# Altium schematic sheet Sheet12.SchDoc
size A4; SheetNumber: 2; SheetTotal: 3
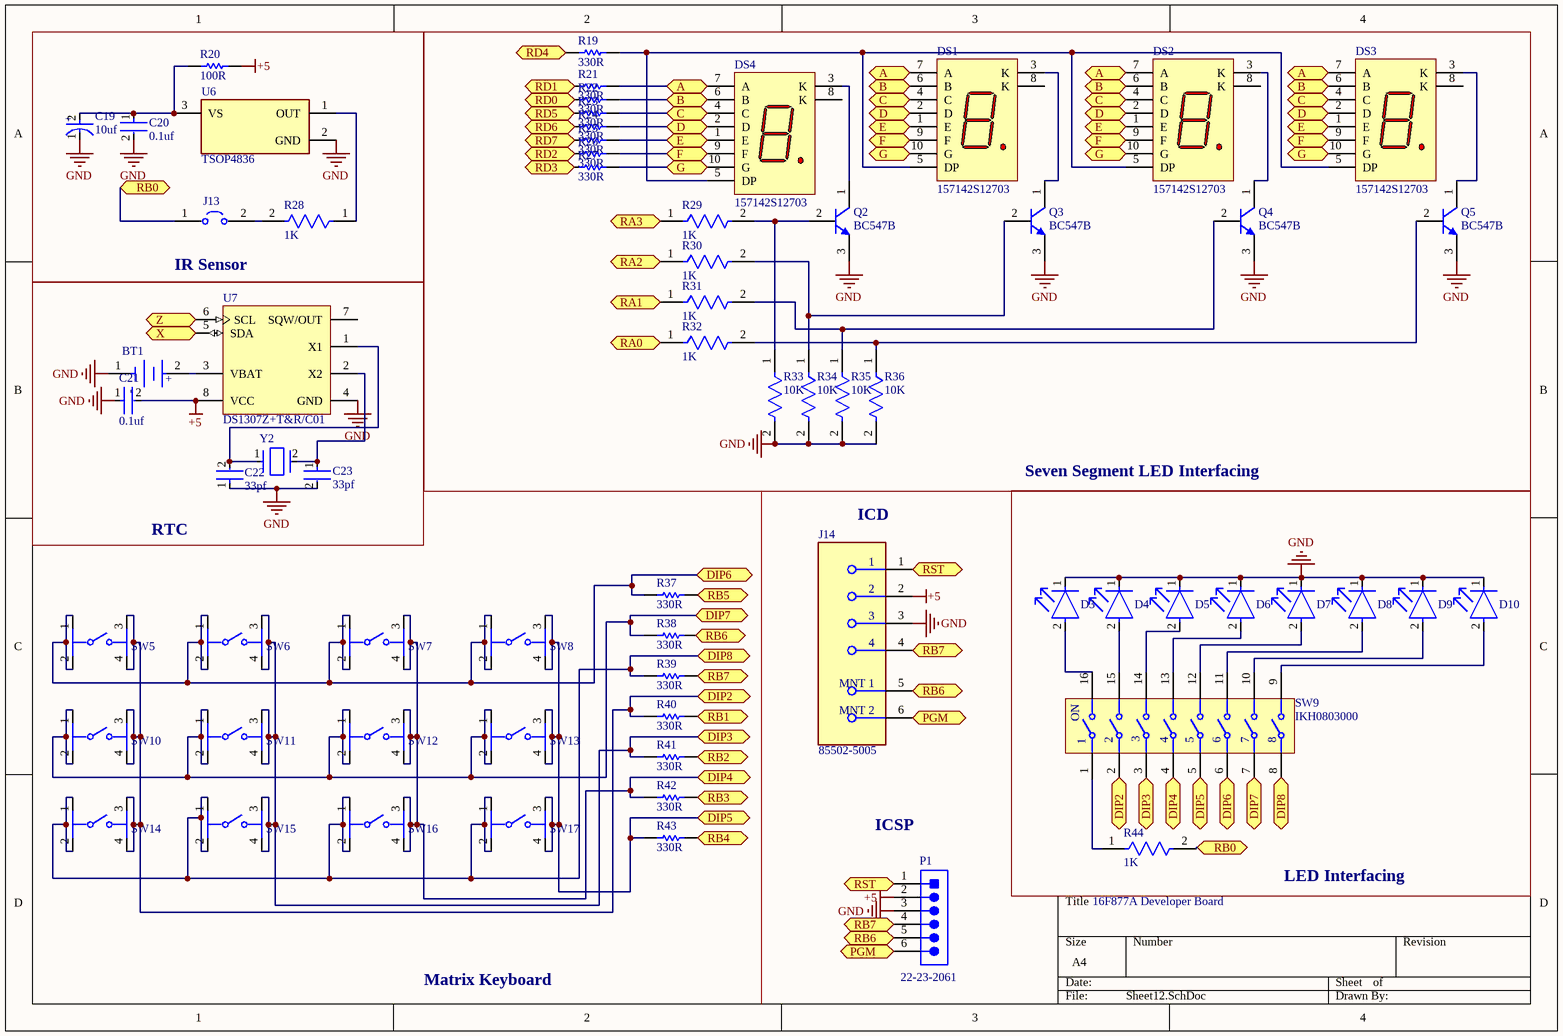
[diagram p0: Sheet12.SchDoc]

## Parts
BT1  3034  [FP-3034-MFG]  (value not drawn)
C19  10uf  [FP-OS-CON-TH-E12-d_0_6-MFG]
C20  0.1uf  [FP-C1206C-EB-MFG]
C21  0.1uf  [FP-C1206C-EB-MFG]
C22  33pf  [FP-RDE1K1-MFG]
C23  33pf  [FP-RDE1K1-MFG]
D3  XLUR12D  [FP-XLUR12D-MFG]  (value not drawn)
D4  XLUR12D  [FP-XLUR12D-MFG]  (value not drawn)
D5  XLUR12D  [FP-XLUR12D-MFG]  (value not drawn)
D6  XLUR12D  [FP-XLUR12D-MFG]  (value not drawn)
D7  XLUR12D  [FP-XLUR12D-MFG]  (value not drawn)
D8  XLUR12D  [FP-XLUR12D-MFG]  (value not drawn)
D9  XLUR12D  [FP-XLUR12D-MFG]  (value not drawn)
D10  XLUR12D  [FP-XLUR12D-MFG]  (value not drawn)
DS1  157142S12703  [WL-T7DS_L19W12.6H7.9]
DS2  157142S12703  [WL-T7DS_L19W12.6H7.9]
DS3  157142S12703  [WL-T7DS_L19W12.6H7.9]
DS4  157142S12703  [WL-T7DS_L19W12.6H7.9]
J13  S1911-46R  [FP-S1911-46R-MFG]  (value not drawn)
J14  85502-5005  [FP-85502-5005-MFG]
P1  22-23-2061  [MOLX-22-23-2061_V]
Q2  BC547B  [ONSC-TO-92-3-29-11]
Q3  BC547B  [ONSC-TO-92-3-29-11]
Q4  BC547B  [ONSC-TO-92-3-29-11]
Q5  BC547B  [ONSC-TO-92-3-29-11]
R19  330R  [RESC3226X70X40ML20T20]
R20  100R  [RESC3116X65X40NL10T20]
R21  330R  [RESC3226X70X40ML20T20]
R22  330R  [RESC3226X70X40ML20T20]
R23  330R  [RESC3226X70X40ML20T20]
R24  330R  [RESC3226X70X40ML20T20]
R25  330R  [RESC3226X70X40ML20T20]
R26  330R  [RESC3226X70X40ML20T20]
R27  330R  [RESC3226X70X40ML20T20]
R28  1K  [FP-RQ732B-IPC_C]
R29  1K  [FP-RQ732B-IPC_C]
R30  1K  [FP-RQ732B-IPC_C]
R31  1K  [FP-RQ732B-IPC_C]
R32  1K  [FP-RQ732B-IPC_C]
R33  10K  [FP-CF18-MFG]
R34  10K  [FP-CF18-MFG]
R35  10K  [FP-CF18-MFG]
R36  10K  [FP-CF18-MFG]
R37  330R  [RESC3226X70X40ML20T20]
R38  330R  [RESC3226X70X40ML20T20]
R39  330R  [RESC3226X70X40ML20T20]
R40  330R  [RESC3226X70X40ML20T20]
R41  330R  [RESC3226X70X40ML20T20]
R42  330R  [RESC3226X70X40ML20T20]
R43  330R  [RESC3226X70X40ML20T20]
R44  1K  [FP-RQ732B-IPC_C]
SW5  TL3305AF260QG  [FP-TL3305AF260QG-MFG]  (value not drawn)
SW6  TL3305AF260QG  [FP-TL3305AF260QG-MFG]  (value not drawn)
SW7  TL3305AF260QG  [FP-TL3305AF260QG-MFG]  (value not drawn)
SW8  TL3305AF260QG  [FP-TL3305AF260QG-MFG]  (value not drawn)
SW9  IKH0803000  [IKH0803000_MFG]
SW10  TL3305AF260QG  [FP-TL3305AF260QG-MFG]  (value not drawn)
SW11  TL3305AF260QG  [FP-TL3305AF260QG-MFG]  (value not drawn)
SW12  TL3305AF260QG  [FP-TL3305AF260QG-MFG]  (value not drawn)
SW13  TL3305AF260QG  [FP-TL3305AF260QG-MFG]  (value not drawn)
SW14  TL3305AF260QG  [FP-TL3305AF260QG-MFG]  (value not drawn)
SW15  TL3305AF260QG  [FP-TL3305AF260QG-MFG]  (value not drawn)
SW16  TL3305AF260QG  [FP-TL3305AF260QG-MFG]  (value not drawn)
SW17  TL3305AF260QG  [FP-TL3305AF260QG-MFG]  (value not drawn)
U6  TSOP4836  [FP-6_550-5169_01-4-MFG]
U7  DS1307Z+T&R/C01  [S8+2_N]
Y2  ECS-80-20-4X  [FP-ECS-80-20-4X-MFG]  (value not drawn)

## Blocks framed on the sheet
IR Sensor: C19 C20 J13 R20 R28 U6
Seven Segment LED Interfacing: DS1-DS4 Q2-Q5 R19 R21-R27 R29-R36
RTC: BT1 C21-C23 U7 Y2

## Ports
A (bidir, see Sheet12[2A], Sheet12[3A]), A (bidir, see Sheet12[2A], Sheet12[3A], Sheet12[4A]), A (bidir, see Sheet12[3A], Sheet12[4A]), B (bidir, see Sheet12[2A], Sheet12[3A]), B (bidir, see Sheet12[2A], Sheet12[3A], Sheet12[4A]), B (bidir, see Sheet12[3A], Sheet12[4A]), C (bidir, see Sheet12[2A], Sheet12[3A]), C (bidir, see Sheet12[2A], Sheet12[3A], Sheet12[4A]), C (bidir, see Sheet12[3A], Sheet12[4A]), D (bidir, see Sheet12[2A], Sheet12[3A]), D (bidir, see Sheet12[2A], Sheet12[3A], Sheet12[4A]), D (bidir, see Sheet12[3A], Sheet12[4A]), DIP2 (bidir, see Sheet12[2C]), DIP2 (bidir, see Sheet12[3D]), DIP3 (bidir, see Sheet12[2C]), DIP3 (bidir, see Sheet12[3D]), DIP4 (bidir, see Sheet12[2D]), DIP4 (bidir, see Sheet12[4D]), DIP5 (bidir, see Sheet12[2D]), DIP5 (bidir, see Sheet12[4D]), DIP6 (bidir, see Sheet12[2C]), DIP6 (bidir, see Sheet12[4D]), DIP7 (bidir, see Sheet12[2C]), DIP7 (bidir, see Sheet12[4D]), DIP8 (bidir, see Sheet12[2C]), DIP8 (bidir, see Sheet12[4D]), E (bidir, see Sheet12[2A], Sheet12[3A]), E (bidir, see Sheet12[2A], Sheet12[3A], Sheet12[4A]), E (bidir, see Sheet12[3A], Sheet12[4A]), F (bidir, see Sheet12[2A], Sheet12[3A]), F (bidir, see Sheet12[2A], Sheet12[3A], Sheet12[4A]), F (bidir, see Sheet12[3A], Sheet12[4A]), G (bidir, see Sheet12[2A], Sheet12[3A]), G (bidir, see Sheet12[2A], Sheet12[3A], Sheet12[4A]), G (bidir, see Sheet12[3A], Sheet12[4A]), PGM (bidir, see Sheet11[4A], Sheet12[3C]), PGM (bidir, see Sheet11[4A], Sheet12[3D]), RA0 (bidir, see Sheet11[3A], Sheet14[2A]), RA1 (bidir, see Sheet11[3A], Sheet14[2A]), RA2 (bidir, see Sheet11[3A], Sheet14[2A]), RA3 (bidir, see Sheet11[3A], Sheet14[2A]), RB0 (bidir, see Sheet11[1D], Sheet11[3A], Sheet12[1A], Sheet14[3A]), RB0 (bidir, see Sheet11[1D], Sheet11[3A], Sheet12[4D], Sheet14[3A]), RB1 (bidir, see Sheet11[3A], Sheet11[4A], Sheet14[3A]), RB2 (bidir, see Sheet11[3A], Sheet14[2C], Sheet14[3A]), RB3 (bidir, see Sheet11[3A], Sheet14[2C], Sheet14[3A]), RB4 (bidir, see Sheet11[3A], Sheet14[3B]), RB5 (bidir, see Sheet11[3B], Sheet14[3B]), RB6 (bidir, see Sheet11[3B], Sheet12[2C], Sheet12[3C], Sheet14[3A]), RB6 (bidir, see Sheet11[3B], Sheet12[2C], Sheet12[3D], Sheet14[3A]), RB6 (bidir, see Sheet11[3B], Sheet12[3C], Sheet12[3D], Sheet14[3A]), RB7 (bidir, see Sheet11[3B], Sheet12[2C], Sheet12[3C], Sheet14[3A]), RB7 (bidir, see Sheet11[3B], Sheet12[2C], Sheet12[3D], Sheet14[3A]), RB7 (bidir, see Sheet11[3B], Sheet12[3C], Sheet12[3D], Sheet14[3A]), RD0 (bidir, see Sheet11[2B], Sheet11[3C], Sheet14[3A]), RD1 (bidir, see Sheet11[2B], Sheet11[3C], Sheet14[3A]), RD2 (bidir, see Sheet11[2B], Sheet11[3D], Sheet14[3A]), RD3 (bidir, see Sheet11[2B], Sheet11[3D], Sheet14[3A]), RD4 (bidir, see Sheet11[2B], Sheet11[3D], Sheet14[3A]), RD5 (bidir, see Sheet11[2B], Sheet11[3D], Sheet14[3A]), RD6 (bidir, see Sheet11[2B], Sheet11[3D], Sheet14[3A]), RD7 (bidir, see Sheet11[2B], Sheet11[3D], Sheet14[3A]), RST (bidir, see Sheet11[2A], Sheet12[3C]), RST (bidir, see Sheet11[2A], Sheet12[3D]), X (bidir, see Sheet11[2D], Sheet11[3A]), Z (bidir, see Sheet11[2D], Sheet11[4A])

## Nets
+5: C21.2 J14.2 P1.2 R20.1 U7.8(VCC)
GND: BT1.1(C) C19.1(C) C20.2 C21.1 C22.1 C23.2 D3.1(C) D4.1(C) D5.1(C) D6.1(C) D7.1(C) D8.1(C) D9.1(C) D10.1(C) J14.3 P1.3 Q2.3(E) Q3.3(E) Q4.3(E) Q5.3(E) R33.2 R34.2 R35.2 R36.2 U6.2(GND) U7.4(GND)
A: DS1.7(A) DS2.7(A) DS3.7(A) DS4.7(A) R21.2 ; port A
B: DS1.6(B) DS2.6(B) DS3.6(B) DS4.6(B) R22.2 ; port B
C: DS1.4(C) DS2.4(C) DS3.4(C) DS4.4(C) R23.2 ; port C
D: DS1.2(D) DS2.2(D) DS3.2(D) DS4.2(D) R24.2 ; port D
DIP2: R40.1 SW5.3 SW5.4 SW10.3 SW10.4 SW14.3 SW14.4 ; port DIP2
DIP3: R41.1 SW6.3 SW6.4 SW11.3 SW11.4 SW15.3 SW15.4 ; port DIP3
DIP4: R42.1 SW7.3 SW7.4 SW12.3 SW12.4 SW16.3 SW16.4 ; port DIP4
DIP5: R43.1 SW8.3 SW8.4 SW13.3 SW13.4 SW17.3 SW17.4 ; port DIP5
DIP6: R37.1 SW5.1 SW5.2 SW6.1 SW6.2 SW7.1 SW7.2 SW8.1 SW8.2 ; port DIP6
DIP7: R38.1 SW10.1 SW10.2 SW11.1 SW11.2 SW12.1 SW12.2 SW13.1 SW13.2 ; port DIP7
DIP8: R39.1 SW14.1 SW14.2 SW15.1 SW15.2 SW16.1 SW16.2 SW17.1 SW17.2 ; port DIP8
E: DS1.1(E) DS2.1(E) DS3.1(E) DS4.1(E) R25.2 ; port E
F: DS1.9(F) DS2.9(F) DS3.9(F) DS4.9(F) R26.2 ; port F
G: DS1.10(G) DS2.10(G) DS3.10(G) DS4.10(G) R27.2 ; port G
PGM: J14.6(MNT_2) P1.6 ; port PGM
RA0: R32.1 ; port RA0
RA1: R31.1 ; port RA1
RA2: R30.1 ; port RA2
RA3: R29.1 ; port RA3
RB0: J13.1 R44.2 ; port RB0
RB1: R40.2 ; port RB1
RB2: R41.2 ; port RB2
RB3: R42.2 ; port RB3
RB4: R43.2 ; port RB4
RB5: R37.2 ; port RB5
RB6: J14.5(MNT_1) P1.5 ; port RB6
RB7: J14.4 P1.4 R39.2 ; port RB7
RD4: R19.1 ; port RD4
RST: J14.1 P1.1 ; port RST
X: U7.5(SDA) ; port X
Z: U7.6(SCL) ; port Z
NetBT1_2: BT1.2(A) U7.3(VBAT)
NetC19_2: C19.2(A) C20.1 R20.2 U6.3(VS)
NetC22_2: C22.2 U7.1(X1) Y2.1
NetC23_1: C23.1 U7.2(X2) Y2.2
NetD3_2: D3.2(A) SW9.16
NetD4_2: D4.2(A) SW9.15
NetD5_2: D5.2(A) SW9.14
NetD6_2: D6.2(A) SW9.13
NetD7_2: D7.2(A) SW9.12
NetD8_2: D8.2(A) SW9.11
NetD9_2: D9.2(A) SW9.10
NetD10_2: D10.2(A) SW9.9
NetDS1_3: DS1.3(K) Q3.1(C)
NetDS1_5: DS1.5(DP) DS2.5(DP) DS3.5(DP) DS4.5(DP) R19.2
NetDS2_3: DS2.3(K) Q4.1(C)
NetDS3_3: DS3.3(K) Q5.1(C)
NetDS4_3: DS4.3(K) Q2.1(C)
NetJ13_2: J13.2 R28.2
NetQ2_2: Q2.2(B) R29.2 R33.1
NetQ3_2: Q3.2(B) R30.2 R34.1
NetQ4_2: Q4.2(B) R31.2 R35.1
NetQ5_2: Q5.2(B) R32.2 R36.1
NetR28_1: R28.1 U6.1(OUT)
NetR44_1: R44.1 SW9.1

Not connected (* = marked no-connect by the designer): DS1 8(K); DS2 8(K); DS3 8(K); DS4 8(K); R21 1; R22 1; R23 1; R24 1; R25 1; R26 1; R27 1; R38 2; SW9 2 3 4 5 6 7 8; U7 7(SQW/OUT)

## Notes on the sheet
- (near J14) ICD
- (near P1) ICSP
- (near R44) 16F877A Developer Board
- LED Interfacing
- Matrix Keyboard
- (in symbol CMP-00638-06323270-1) ON
- (in symbol CMP-05428-000118-1) +
- (in symbol CMP-19636-000006-1) +; -

## Library data of the parts
BT1 = CMP-19636-000006-1: BATTERY RETAINER COIN 20MM SMD; Manufacturer: Keystone Electronics; Number Of Contacts: 2; Height: 4.31mm; Device Class L1: Connectors; Device Class L3: unset; RoHS: TRUE; Automotive: No; Mouser Description: Coin Cell Battery Holders COIN CELL RETAINER; Contact Material: Nickel; Digikey Description: BATTERY RETAINER COIN 20MM SMD; Category: Batt; Package: 3034; ComponentLink2URL: https://www.keyelco.com/product-pdf.cfm?p=798; Manufacturer Part Number: 3034; Octopart: https://octopart.com/3034-keystone-27554462; ComponentLink2Description: Datasheet; Device Class L2: unset; Lead Free: Yes
C19 = CMP-05428-000118-1: Conductive Polymer Aluminum Solid Capacitors (OS-CON) 18uF ±20% 100V RADIAL TH 8x12mm; ESR (Equivalent Series Resistance): 40mR; Capacitance: 18uF; Max Operating Temperature: 125°C; Voltage Rating: 100V; Case/Package: Radial; Mount: Through Hole; Min Operating Temperature: -55°C; Series: OS-CON™, SXE; Tolerance: 20%
C20 C21 = CMP-03020-018297-1: C1206 0.10 μF U2J 20.00% 50 V; Manufacturer: KEMET; Manufacturer Part Number: C1206C104M5JACAUTO; Voltage Rating: 50 V; Automotive Grade: Grade 0; Capacitance: 0.10 μF; Value: 0.10 μF; Temperature Coefficient: 15%; Tolerance: 0.2; Material: Ceramic; Height: 0.88mm; Lead Free: Yes; ComponentLink2Description: Datasheet; ComponentLink2URL: https://content.kemet.com/datasheets/KEM_C1007_X8R_ULTRA_150C_SMD.pdf; Ipc Land Pattern Name: CAPC320160X78; Temperature Characteristic: U2J; RoHS: TRUE; Octopart: https://octopart.com/c1206c104m5jacauto-kemet-84732526; Package: C1206C-EB; Temperature Range Low: -55°C; Automotive: Yes; Temperature Range High: +150°C; Category: Cap; Device Class L3: Ceramic Capacitors; Device Class L2: Capacitors; Temperature: -55°C to +150°C; Device Class L1: Passive Components
C22 C23 = CMP-06035-044214-1: Ceramic Capacitor 33pF ±5% 630V C0G Radial
D3-D10 = CMP-02085-08376351-1: 627nm Red LED; 5x8.6mm, Through-Hole Mount with Red Diffused Round Lamp; Test Current: 10mA; Viewing Angle: 30°; Dominant Wavelength: 617nm; Luminous Intensity: 39mcd; Forward Voltage: 1.9V; Wavelength: 627nm; Case/Package: Radial; Lens Color: Red; Mount: Through Hole; Height: 8.6mm; Color: Red; Lifecycle Status: Production; Lens Transparency: Diffused; RoHS: Compliant
DS1-DS4 = CMP-03913-119894002-2: 7-Seg Display, Comm Cathode, Super Red Rohs Compliant: Yes; Forward Voltage: 2V; Dominant Wavelength: 635nm; Forward Current: 100mA; Max Reverse Voltage (DC): 5V; Luminous Intensity: 20mcd; Min Operating Temperature: -40°C; RoHS: Compliant; Length: 19mm; Width: 12.6mm; Max Operating Temperature: 85°C; Height: 8mm
J13 = CMP-15817-000009-1: JUMPER TIN SMD; Gender: Non-Gendered; Current Rating: 10A; Number of Contacts: 2; Pitch: 0.119inch; Material: Brass; REACH SVHC: No SVHC; Number of Rows: 1; Plating: Tin; Contact Plating: Tin; Length: 6.85mm; RoHS Compliant: Yes; Height: 0.038inch; Packaging: Tape and Reel; Contact Material: Brass; Orientation: Straight; Termination: SMD/SMT; Depth: 2.51mm; Color: Silver; Number of Positions: 2; Series: S1; Package Quantity: 4000
J14 = CMP-04778-000028-1: CONN MOD JACK 4P4C R/A UNSHLD; Pitch: 1.27mm; Number of Positions: 4; Insulation Resistance: 500MR; Gender: Female; Shielding: Unshielded; Number of Ports: 1; Connector Type: Socket; Max Voltage Rating (AC): 125V; Number of Circuits: 2; Current Rating: 1.5A; Contact Resistance: 20mR; Halogen Free: Low Halogen; Width: 11.5mm; Flammability Rating: UL94 V-0; Radiation Hardening: No; Packaging: Tape and Reel; Min Operating Temperature: -40°C; Package Quantity: 1470; RoHS Compliant: Yes; Color: Black; Number of Positions Loaded: 4; Contact Plating: Gold; Depth: 18.1mm; Mount: Surface Mount; Orientation: Right Angle; Contact Material: Brass; Termination: SMD/SMT; Housing Material: Polymer; Length: 14.13mm; Series: 85502; Voltage Rating (AC): 125V; Housing Color: Black; Max Operating Temperature: 80°C; Number of Contacts: 4
P1 = CMP-2000-05536-1: Male Header, Pitch 2.54 mm, 1 x 6 Position, Height 10.67 mm, Tail Length 3.56 mm, 0 to 70 degC, RoHS, Bulk; Manufacturer: Molex; Pitch: 2.54mm; Mounting Angle: Vertical; Current Rating: 4A; Number of Positions / Contacts: 6; Voltage Rating: 250V; Packaging: Bulk; Package Description: Male Header, Pitch 2.54 mm, 1 x 6 Position, Height 10.67 mm, Tail Length 3.56 mm; Number of Rows: 1; Type: PinStrip; Contact Material: Brass; Product Category: .100K.K.Connectors; Factory Pack Quantity: 1000; Mounting Style: ThroughHole; RoHS: Details; Contact Plating: Tin; Housing Material: Nylon; Mounting Technology: ThroughHole; Termination Style: ThroughHole; Tradename: KK; Number of Positions: 6; Brand: Molex; Product Type: Headers; Series: 6373; Datasheet URL: https://datasheet.ciiva.com/19460/232303-19460895.pdf; Package Reference: 22-23-2061; Datasheet Version: Rev. P, 09/2001; Manufacturer URL: http://www.molex.com/
Q2-Q5 = CMP-1048-01467-1: Amplifier Transistor, NPN Silicon, 3-Pin TO-92, Bulk Box; Manufacturer: On Semiconductor; IC Continuous (A): 0.1; fT Min (MHz): 150; DatasheetVersion: Rev. 7; ComponentLink1URL: http://www.onsemi.com/; Polarity: NPN; RoHS: FALSE; ComponentLink1Description: Manufacturer URL; Packing: Bulk Box; PackageDescription: 3-Pin Transistor Outline, Body 4.825 x 3.685 mm, Pitch 1.27 mm; ComponentLink3URL: http://www.onsemi.cn/pub_link/Collateral/2N6426-D.PDF; ComponentLink2Description: Datasheet; PackageVersion: Rev. AM; PackageReference: TO-92-3-29-11_AM_SL; ComponentLink3Description: Package Specification; Mounting Technology: Through Hole; PartNumber: BC547B; ComponentLink2URL: http://www.onsemi.com/pub_link/Collateral/BC546-D.PDF
R19 R21-R27 R37-R43 = CMP-2005-02232-1: Manufacturer: KOA Speer; Part Number: RK73B2ETTE331J
R20 = CMP-2003-04959-1: Manufacturer: Yageo; Part Number: RC1206FR-10100RL
R28-R32 R44 = CMP-03211-006012-1: RQ732B 1206 1KΩ 0.4W 10ppm/°C 0.1% 200V; Manufacturer: TE; Manufacturer Part Number: RQ73C2B1K0BTDF; Automotive Grade: Grade 0; ComponentLink2URL: https://www.te.com/commerce/DocumentDelivery/DDEController?Action=showdoc&DocId=Data+Sheet%7F1773270-2%7FA%7Fpdf%7FEnglish%7FENG_DS_1773270-2_A.pdf%7F9-2176388-1149; Device Class L2: Resistors; Tolerance: 0.1%; Temperature Coefficient: 10ppm/°C; Resistance: 1KΩ; Value: 1KΩ; Temperature Range High: +155°C; Temperature Range Low: -55°C; Package: RQ732B; Composition: Thin Film; Lead Free: Yes; Power Rating: 0.4W; Voltage Rating: 200V; RoHS: TRUE; Device Class L1: Passive Components; Device Class L3: Chip SMD Resistors; Octopart: https://octopart.com/rq73c2b1k0btdf-te+connectivity-99292457; Category: Res; Automotive: Yes; Ipc Land Pattern Name: RESC310160X60; Height: 0.75mm; Temperature: -55°C to +155°C; ComponentLink2Description: Datasheet; Series: RQ73
R33-R36 = CMP-26528-000002-1: RES 10K OHM 1/8W 5% CF AXIAL; Manufacturer Part Number: CF18JT10K0; Manufacturer: Stackpole Electronics; Power Rating: 0.125W; Temperature Coefficient: 0-500ppm/°C; Resistance: 10kΩ; Voltage Rating: 250V; Value: 10kΩ; Temperature: -55°C to +155°C; Height: 2mm; Lead Free: Yes; Automotive: No; Device Class L2: Resistors; Package: CF18; Series: CF; ComponentLink2Description: Datasheet; Ipc Land Pattern Name: RESAD656W65L360D200; Temperature Range High: +155°C; RoHS: TRUE; Device Class L3: Through-Hole Resistors; Temperature Range Low: -55°C; Device Class L1: Passive Components; Category: Res; Octopart: https://octopart.com/cf18jt10k0-stackpole+electronics-19205642; Composition: Carbon Film; Digikey Description: RES 10K OHM 1/8W 5% CF AXIAL; ComponentLink2URL: http://www.seielect.com/Catalog/SEI-CF_CFM.pdf; Tolerance: 5%
SW5-SW8 SW10-SW17 = CMP-17879-000010-1: SWITCH TACTILE SPST-NO 50MA 12V; Mechanical Life: 200000Cycles; Switch Function: Off-Mom; Actuator Type: Standard; Operating Force: 260gf; Illumination Type: Non-Illuminated; Switch Travel: 0.2mm; Throw Configuration: SPST; Min Operating Temperature: -20°C; Max Operating Temperature: 70°C; Lead Free: Lead Free; Mount: Surface Mount; Packaging: Tape and Reel; Termination: Gull Wing
SW9 = CMP-00638-06323270-1: Switch DIP ON OFF SPST 8 Recessed Slide 0.025A 24VDC Gull Wing 1.27mm SMD Tube; Number of Positions: 8; Voltage Rating (DC): 50V; Electrical Life: 1kcycles; Insulation Resistance: 100MΩ; Washable: Yes; Current Rating: 25mA; Max Operating Temperature: 70°C; ComponentLink2URL: https://www.apem.com/media/apemProduct/IKH_Series_Dual_in_Line_2018.pdf; ComponentLink2Description: Datasheet URL; ComponentLink1URL: http://www.apem.com/; Terminal Pitch: 1.27mm; Mount: Surface Mount; RoHS: Compliant; Contact Material: Bronze; Throw Configuration: SPST; Min Operating Temperature: -20°C; Number of Pins: 8; Termination: Solder; HelpURL: https://www.apem.com/media/apemProduct/IKH_Series_Dual_in_Line_2018.pdf; ComponentLink1Description: Manufacturer's Website
U6 = CMP-00030-55401809-1: TSOP4836 TSOP48 Series 5.5 V 36 kHz Through Hole IR Receiver Modules for Remote Control; Min Supply Voltage (DC): 2.5V; Max Supply Voltage (DC): 5.5V; Lead Length: 23.6mm; Power Dissipation: 10mW; Nominal Supply Current: 950µA; Wavelength: 950nm; Sensing Distance: 45m; Operating Supply Current: 700µA; Viewing Angle: 45°; Frequency: 36kHz; Output Current: 5mA; Min Supply Voltage: 2.7V; Height: 6.95mm; RoHS: Compliant; Mount: Through Hole; NexarPartId: 55401809; Case/Package: TSOP; Max Supply Voltage: 5.5V; Width: 5.6mm; REACH SVHC: Unknown; Lead Free: Lead Free; Schedule B: 8541409500; Min Operating Temperature: -25°C; Radiation Hardening: No; Max Operating Temperature: 85°C; Length: 6mm; Contact Plating: Tin; Number of Pins: 3; Orientation: Side View
U7 = CMP-0254-00302-1: 64 x 8, Serial, I2C Real-Time Clock, 5.0V, 8-Pin SO, 0 to 70 degC, Pb-Free, Reel; ComponentLink1URL: http://www.maxim-ic.com; PackageReference: S8+2; ComponentLink3URL: http://pdfserv.maxim-ic.com/package_dwgs/21-0041.PDF; Code_JEDEC: MS-012-AA; PackageDescription: 8-Pin Small-Outline IC, Narrow (0.15in), 1.27 mm Pitch, SOIC (N), Pb-Free; PackageVersion: revC, 2010; ComponentLink3Description: Package Specification; Code_IPC: SOIC127P600-8; ComponentLink1Description: Manufacturer URL; DatasheetVersion: 10-Feb-2008; ComponentLink2Description: Datasheet; ComponentLink2URL: http://datasheets.maxim-ic.com/en/ds/DS1307.pdf
Y2 = CMP-1669-00002-3: NexarPartId: 316504; Frequency Stability: 50ppm; ESR (Equivalent Series Resistance): 80Ω; Frequency: 8MHz; Tolerance: 0.003%; Load Capacitance: 20pF; Schedule B: 8541600025, 8541600025; Number of Pins: 49; Max Operating Temperature: 70°C; Lead Free: Lead Free; Height: 3.5mm; Termination: Radial; RoHS: Compliant; Frequency Tolerance: 0.003%; Packaging: Bulk; Mount: Through Hole; Width: 4.65mm; Length: 11.3538mm; Min Operating Temperature: -10°C